# EAGLE design EFM32TG110_BreakoutBoard (EAGLE 6.2)
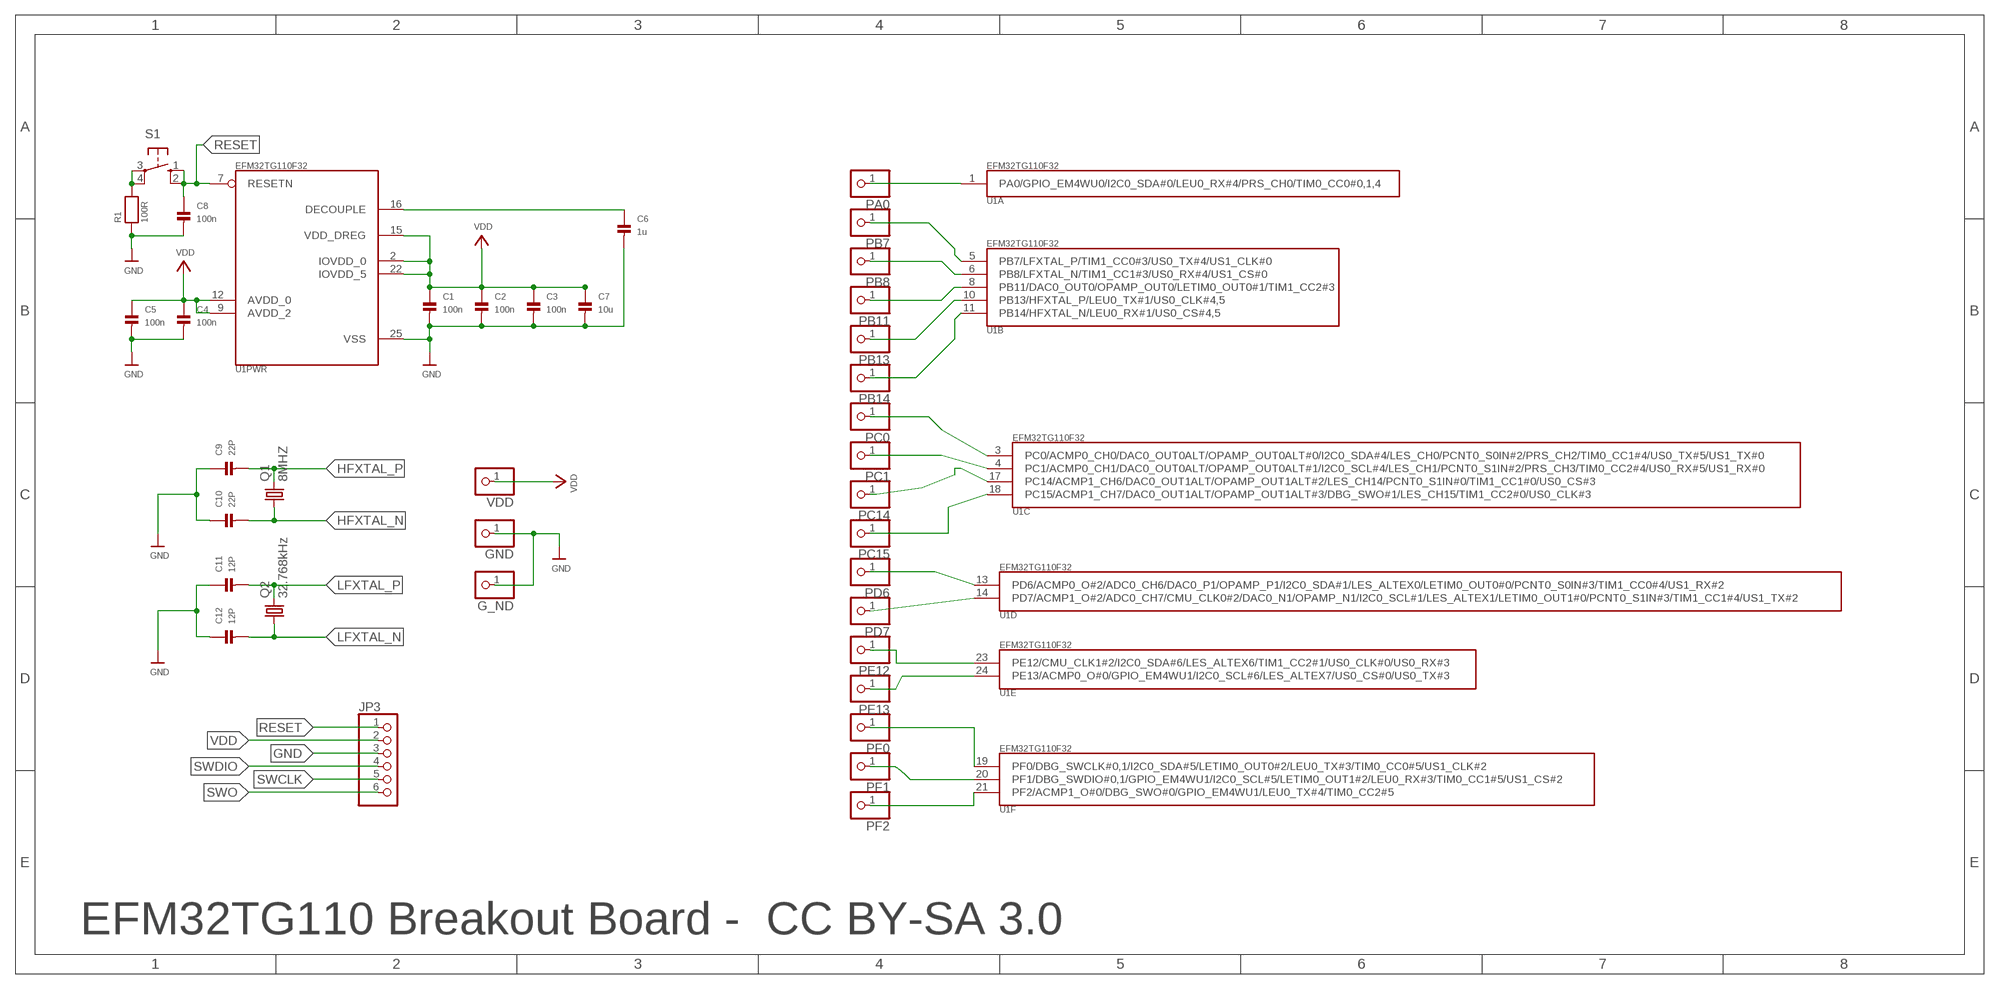
[diagram p0: schematic, sheet 1]

## Parts
C1  100n  CAP_CERAMIC0603  [0603]
C2  100n  CAP_CERAMIC0603  [0603]
C3  100n  CAP_CERAMIC0603  [0603]
C4  100n  CAP_CERAMIC0603  [0603]
C5  100n  CAP_CERAMIC0603  [0603]
C6  1u  CAP_CERAMIC0805  [0805]
C7  10u  CAP_CERAMIC0805  [0805]
C8  100n  CAP_CERAMIC0603  [0603]
C9  22P  CAP_CERAMIC0603  [0603]
C10  22P  CAP_CERAMIC0603  [0603]
C11  12P  CAP_CERAMIC0603  [0603]
C12  12P  CAP_CERAMIC0603  [0603]
G_ND  HEADER-1X1ROUND  [1X01_ROUND]
GND  HEADER-1X1ROUND  [1X01_ROUND]
JP3  HEADER-1X6  [1X06_OVAL]
PA0  HEADER-1X1ROUND  [1X01_ROUND]
PB7  HEADER-1X1ROUND  [1X01_ROUND]
PB8  HEADER-1X1ROUND  [1X01_ROUND]
PB11  HEADER-1X1ROUND  [1X01_ROUND]
PB13  HEADER-1X1ROUND  [1X01_ROUND]
PB14  HEADER-1X1ROUND  [1X01_ROUND]
PC0  HEADER-1X1ROUND  [1X01_ROUND]
PC1  HEADER-1X1ROUND  [1X01_ROUND]
PC14  HEADER-1X1ROUND  [1X01_ROUND]
PC15  HEADER-1X1ROUND  [1X01_ROUND]
PD6  HEADER-1X1ROUND  [1X01_ROUND]
PD7  HEADER-1X1ROUND  [1X01_ROUND]
PE12  HEADER-1X1ROUND  [1X01_ROUND]
PE13  HEADER-1X1ROUND  [1X01_ROUND]
PF0  HEADER-1X1ROUND  [1X01_ROUND]
PF1  HEADER-1X1ROUND  [1X01_ROUND]
PF2  HEADER-1X1ROUND  [1X01_ROUND]
Q1  8MHZ  CRYSTALHC49U70  [HC49U70]
Q2  32.768kHz  CRYSTALTC38H  [TC38H]
R1  100R  RESISTOR0603  [0603]
S1  10-XX  [B3F-10XX]
U1  EFM32TG110F32  [QFN24]
VDD  HEADER-1X1ROUND  [1X01_ROUND]

## Nets
GND [power]: C1.2 C2.2 C3.2 C4.2 C5.2 C6.2 C7.2 C8.2 C9.1 C10.1 C11.1 C12.1 G_ND.1 GND.1 JP3.3 R1.1 U1.25(PWR:VSS)
HFXTAL_N: C10.2 PB14.1 Q1.1 U1.11(B:PB14/HFXTAL_N/LEU0_RX#1/US0_CS#4,5)
HFXTAL_P: C9.2 PB13.1 Q1.2 U1.10(B:PB13/HFXTAL_P/LEU0_TX#1/US0_CLK#4,5)
LFXTAL_N: C12.2 PB8.1 Q2.1 U1.6(B:PB8/LFXTAL_N/TIM1_CC1#3/US0_RX#4/US1_CS#0)
LFXTAL_P: C11.2 PB7.1 Q2.2 U1.5(B:PB7/LFXTAL_P/TIM1_CC0#3/US0_TX#4/US1_CLK#0)
N$1: PA0.1 U1.1(A:PA0/GPIO_EM4WU0/I2C0_SDA#0/LEU0_RX#4/PRS_CH0/TIM0_CC0#0,1,4)
N$3: C6.1 U1.16(PWR:DECOUPLE)
N$5: PB11.1 U1.8(B:PB11/DAC0_OUT0/OPAMP_OUT0/LETIM0_OUT0#1/TIM1_CC2#3)
N$8: PC0.1 U1.3(C:PC0/ACMP0_CH0/DAC0_OUT0ALT/OPAMP_OUT0ALT#0/I2C0_SDA#4/LES_CH0/PCNT0_S0IN#2/PRS_CH2/TIM0_CC1#4/US0_TX#5/US1_TX#0)
N$9: PC1.1 U1.4(C:PC1/ACMP0_CH1/DAC0_OUT0ALT/OPAMP_OUT0ALT#1/I2C0_SCL#4/LES_CH1/PCNT0_S1IN#2/PRS_CH3/TIM0_CC2#4/US0_RX#5/US1_RX#0)
N$10: PC14.1 U1.17(C:PC14/ACMP1_CH6/DAC0_OUT1ALT/OPAMP_OUT1ALT#2/LES_CH14/PCNT0_S1IN#0/TIM1_CC1#0/US0_CS#3)
N$11: PC15.1 U1.18(C:PC15/ACMP1_CH7/DAC0_OUT1ALT/OPAMP_OUT1ALT#3/DBG_SWO#1/LES_CH15/TIM1_CC2#0/US0_CLK#3)
N$12: PD6.1 U1.13(D:PD6/ACMP0_O#2/ADC0_CH6/DAC0_P1/OPAMP_P1/I2C0_SDA#1/LES_ALTEX0/LETIM0_OUT0#0/PCNT0_S0IN#3/TIM1_CC0#4/US1_RX#2)
N$13: PD7.1 U1.14(D:PD7/ACMP1_O#2/ADC0_CH7/CMU_CLK0#2/DAC0_N1/OPAMP_N1/I2C0_SCL#1/LES_ALTEX1/LETIM0_OUT1#0/PCNT0_S1IN#3/TIM1_CC1#4/US1_TX#2)
N$14: PE12.1 U1.23(E:PE12/CMU_CLK1#2/I2C0_SDA#6/LES_ALTEX6/TIM1_CC2#1/US0_CLK#0/US0_RX#3)
N$15: PE13.1 U1.24(E:PE13/ACMP0_O#0/GPIO_EM4WU1/I2C0_SCL#6/LES_ALTEX7/US0_CS#0/US0_TX#3)
N$21: R1.2 S1.3(P) S1.4(P1)
RESET: C8.1 JP3.1 S1.1(S) S1.2(S1) U1.7(PWR:RESETN)
SWCLK: JP3.5 PF0.1 U1.19(F:PF0/DBG_SWCLK#0,1/I2C0_SDA#5/LETIM0_OUT0#2/LEU0_TX#3/TIM0_CC0#5/US1_CLK#2)
SWDIO: JP3.4 PF1.1 U1.20(F:PF1/DBG_SWDIO#0,1/GPIO_EM4WU1/I2C0_SCL#5/LETIM0_OUT1#2/LEU0_RX#3/TIM0_CC1#5/US1_CS#2)
SWO: JP3.6 PF2.1 U1.21(F:PF2/ACMP1_O#0/DBG_SWO#0/GPIO_EM4WU1/LEU0_TX#4/TIM0_CC2#5)
VDD [power]: C1.1 C2.1 C3.1 C4.1 C5.1 C7.1 JP3.2 U1.2(PWR:IOVDD_0) U1.9(PWR:AVDD_2) U1.12(PWR:AVDD_0) U1.15(PWR:VDD_DREG) U1.22(PWR:IOVDD_5) VDD.1

## Notes on the sheet
- EFM32TG110 Breakout Board -  CC BY-SA 3.0

## Library data of the parts
C1-C12 = myLibrary:CAP_CERAMIC: Ceramic Capacitors 0402 - 0402 Surface Mount Capacitors 16pF 50V 5% [Digikey: 445-4899-2-ND] 18pF 50V 5% [Digikey: 490-1281-2-ND] 22pF 50V 5% [Digikey: 490-1283-2-ND] 68pF 50V 5% [Digikey: 490-1289-2-ND] 0.1uF 10V 10% [Digikey: 490-1318-2-ND] 1.0uF 6.3V 10% [Digikey: 490-1320-2-ND] 0603 - 0603 Surface Mount Capacitors 16 pF 50V 5% [Digikey: 445-5051-2-ND] 22 pF 50V [Digikey: PCC220ACVTR-ND] 33 pF 50V 5% [Digikey: 490-1415-1-ND] 56pF 50V 5% [Digikey: 490-1421-1-ND] 220pF 50V 5% [Digikey: 445-1285-1-ND] 680 pF 50V 2200 pF 50V 5% C0G [Digikey: 445-1297-1-ND] 5600 pF 100V 5% X7R [Digikey: 478-3711-1-ND] 0.1 µF 25V 10% [Digikey: PCC2277TR-ND] 0.22 µF 16V 10% X7R [Digikey: 445-1318-1-ND] 1.0 µF 25V 10% [Digikey: 445-5146-2-ND] 0603 - RF Specific 3pF 250V +/-0.1pF RF [Digikey: 712-1347-1-ND] 18 pF 250V 5% [Digikey: 478-3505-1-ND or 712-1322-1-ND] 56 pF 250V 5% C0G RF [Digikey: 490-4867-1-ND] 68 pF 250V RF [Digikey: 490-4868-1-ND] 0805 - 0805 Surface Mount Capacitors 220 pF 250V 2% RF Ceramic Capacitor [Digikey: 712-1398-1-ND] 1000 pF 50V 2% NP0 Ceramic Capacitor [Digikey: 478-3760-1-ND] 0.1 µF 25V 10% Ceramic Capacitor [Digikey: PCC1828TR-ND] 1.0 µF 16V 10% Ceramic Capacitor[Digikey: 490-1691-2-ND] 10.0 µF 10V 10% Ceramic Capacitor[Digikey: 709-1228-1-ND] 10.0 uF 16V 10% Ceramic Capacitor [Digikey: 478-5165-2-ND] 47 uF 6.3V 20% Ceramic Capacitor [Digikey: 587-1779-1-ND or 399-5506-1-ND] 1206 - 1206 Surface Mount Capacitors 47uF 10V 20% Ceramic Capacitor [Digikey: 490-5528-1-ND or 399-5508-1-ND or 445-6010-1-ND]
G_ND GND PA0 PB7 PB8 PB11 PB13 PB14 PC0 PC1 PC14 PC15 PD6 PD7 PE12 PE13 PF0 PF1 PF2 VDD = myLibrary:HEADER-1X1: PIN HEADER
JP3 = myLibrary:HEADER-1X6: PIN HEADER
Q1 Q2 = crystal:CRYSTAL: CRYSTAL; OC_FARNELL: unknown; OC_NEWARK: unknown
R1 = myLibrary:RESISTOR: Resistors 0402 - 0402 Surface Mount Package 22 Ohm 1% 1/16W [Digikey: 311-22.0LRTR-ND] 33 Ohm 5% 1/16W 1.0K 5% 1/16W 1.5K 5% 1/16W 2.0K 1% 1/16W 10.0K 1% 1/16W [Digikey: 311-10.0KLRTR-ND] 10.0K 5% 1/16W [Digikey: RMCF0402JT10K0TR-ND] 12.1K 1% 1/16W [Digikey: 311-22.0LRTR-ND] 100.0K 5% 1/16W 0603 - 0603 Surface Mount Package 0 Ohm 1/10 Watt 1% Resistor 15 Ohm 1/10 Watt 1% Resistor 33 Ohm 1/10 Watt 1% Resistor 49.9 Ohm 1/10 Watt 1% Resistor 100 Ohm 1/10 Watt 1% Resistor 150 Ohm 1/10 Watt 1% Resistor 240 Ohm 1/10 Watt 1% Resistor 390 Ohm 1/10 Watt 1% Resistor 560 Ohm 1/10 Watt 1% Resistor 680 Ohm 1/10 Watt 1% Resistor 750 Ohm 1/10 Watt 1% Resistor 1.0K Ohm 1/10 Watt 1% Resistor 1.5K Ohm 1/10 Watt 1% Resistor 2.0K Ohm 1/10 Watt 1% Resistor 2.2K Ohm 1/10 Watt 1% Resistor 3.3K Ohm 1/10 Watt 1% Resistor 4.7K Ohm 1/10 Watt 1% Resistor 10.0K Ohm 1/10 Watt 1% Resistor 12.0K Ohm 1/10 Watt 1% Resistor 12.1K Ohm 1/10 Watt 1% Resistor 20.0K Ohm 1/10 Watt 1% Resistor 33.0K Ohm 1/10 Watt 1% Resistor 100.0K Ohm 1/10 Watt 1% Resistor 0805 - 0805 Surface Mount Package 0 Ohm 1/8 Watt 1% Resistor 33 Ohm 1/8 Watt 1% Resistor 100 Ohm 1/8 Watt 1% Resistor 150 Ohm 1/8 Watt 1% Resistor 200 Ohm 1/8 Watt 1% Resistor 240 Ohm 1/8 Watt 1% Resistor 330 Ohm 1/8 Watt 1% Resistor 390 Ohm 1/8 Watt 1% Resistor 470 Ohm 1/8 Watt 1% Resistor 1.0K Ohm 1/8 Watt 1% Resistor 1.5K Ohm 1/8 Watt 1% Resistor 2.0K Ohm 1/8 Watt 1% Resistor 4.7K Ohm 1/8 Watt 1% Resistor 5.1K Ohm 1/8 Watt 1% Resistor 5.6K Ohm 1/8 Watt 1% Resistor 10.0K Ohm 1/8 Watt 1% Resistor 22.0K Ohm 1/8 Watt 1% Resistor 33.0K Ohm 1/8 Watt 1% Resistor 100K Ohm 1/8 Watt 1% Resistor 1206 - 1206 Surface Mount Package 2012 - 2010 Surface Mount Package 0.11 Ohm 1/2 Watt 1% Resistor - Digikey: RHM.11UCT-ND
S1 = switch-omron:10-XX: OMRON SWITCH; MPN: B3F-1000; OC_FARNELL: 176432; OC_NEWARK: 36M3542
U1 = EnergyMicro:EFM32TG110F32: EFM32TG110F32 Tiny Microcontroller in 5mm x 5mm QFN24 package

## Net classes
0 default: width 0.254 mm, clearance 0.254 mm
1 power: width 0.406 mm, clearance 0.254 mm

## Board
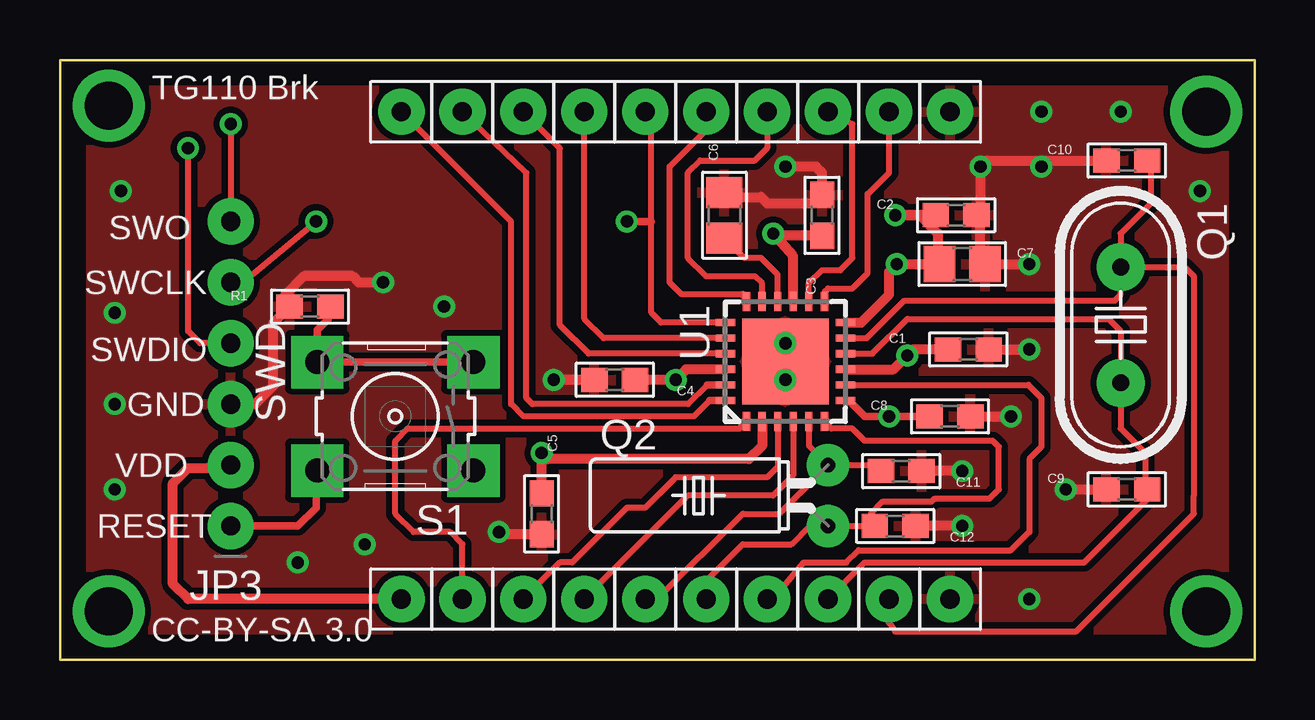
[diagram p1: board, top side]
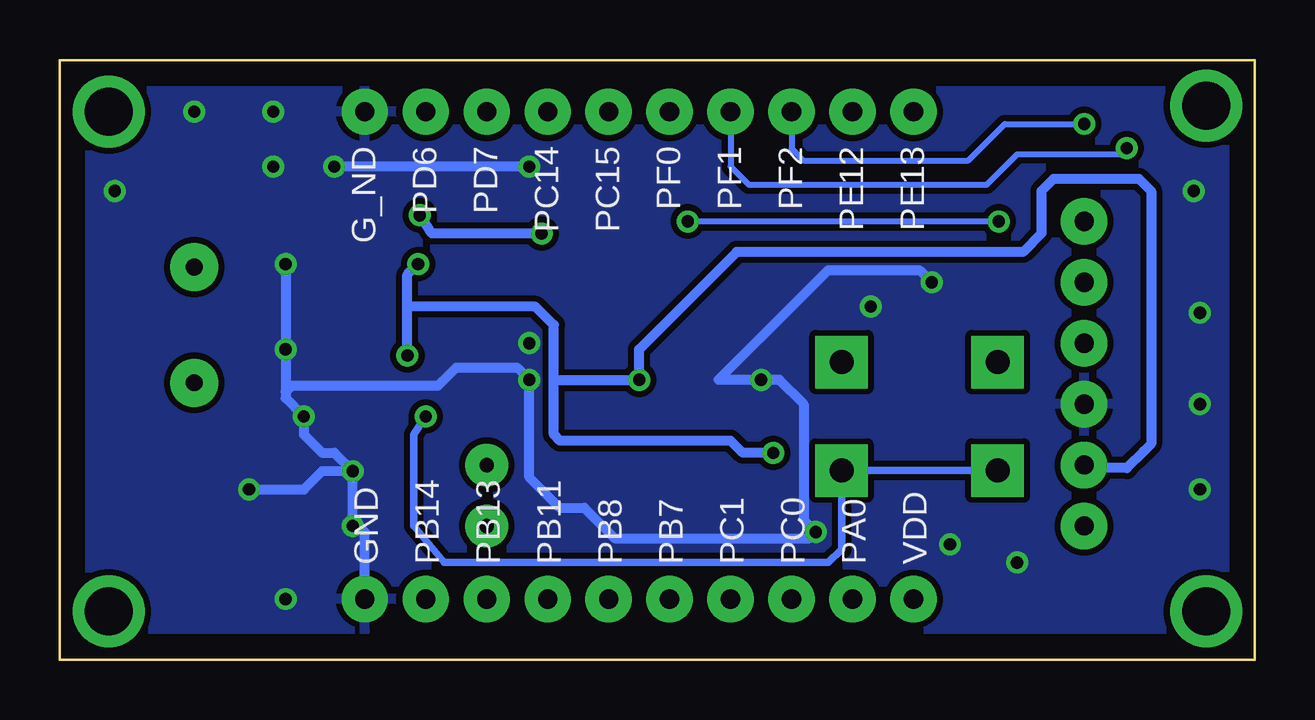
[diagram p2: board, bottom side, seen from below]

Size 49.78 x 25.02 mm. Coordinates in mm from the lower left corner, seen from the top.
Outline: 0,0 49.78,0 49.78,25.02 0,25.02 0,0
Copper layers (1*16): Top 0.035mm / dielectric 1.5mm / Bottom 0.035mm
Design rules: minimum track width 10mil, minimum drill 24mil, track to track 10mil, track to pad 10mil, pad to pad 10mil, via to via 10mil, smd to smd 0mil, copper to edge 40mil, drill to drill 8mil, minimum pad ring 10mil, minimum via ring 8mil, stop-mask expansion 4mil, vias tented up to drill 0mil, thermal gap 10mil

### Footprints (pad centres in the part's own frame; a part is rotated, then mirrored left to right if it is on the bottom)
0603 = smd 1.1 x 1: 1 -0.85,0; 2 0.85,0
0805 = smd 1.3 x 1.5: 1 -0.95,0; 2 0.95,0
1X01_ROUND = drill 0.8 pad 1.93: 1 0,0
1X06_OVAL = drill 0.8 pad 1.93: 1 -6.35,0; 2 -3.81,0; 3 -1.27,0; 4 1.27,0; 5 3.81,0; 6 6.35,0
HC49U70 = drill 0.7 pad 2: 1 -2.413,0; 2 2.413,0
TC38H = drill 0.6 pad 1.778: 1 -1.27,0; 2 1.27,0
B3F-10XX = drill 1 pad 2.184 square: 1 -3.251,2.261; 2 3.251,2.261; 3 -3.251,-2.261; 4 3.251,-2.261
QFN24 = smd 0.8 x 0.3: 1 -2.5,1.625; 2 -2.5,0.975; 3 -2.5,0.325; 4 -2.5,-0.325; 5 -2.5,-0.975; 6 -2.5,-1.625; 13 2.5,-1.625; 14 2.5,-0.975; 15 2.5,-0.325; 16 2.5,0.325; 17 2.5,0.975; 18 2.5,1.625 | smd 0.3 x 0.8: 7 -1.625,-2.5; 8 -0.975,-2.5; 9 -0.325,-2.5; 10 0.325,-2.5; 11 0.975,-2.5; 12 1.625,-2.5; 19 1.625,2.5; 20 0.975,2.5; 21 0.325,2.5; 22 -0.325,2.5; 23 -0.975,2.5; 24 -1.625,2.5 | smd 3.6 x 3.6: 25 0,0

### Placement (x,y rotation side)
C1  37.85,12.95 0 top
C2  37.34,18.54 0 top
C3  31.75,18.54 90 top
C4  23.11,11.68 180 top
C5  20.07,6.1 270 top
C6  27.69,18.54 90 top
C7  37.59,16.51 0 top
C8  37.08,10.16 0 top
C9  44.45,7.11 0 top
C10  44.45,20.83 0 top
C11  35.05,7.87 180 top
C12  34.8,5.59 180 top
G_ND  37.08,22.86 180 top
GND  37.08,2.54 0 top
JP3  7.11,11.94 90 top
PA0  16.76,2.54 0 top
PB7  24.38,2.54 0 top
PB8  26.92,2.54 0 top
PB11  29.46,2.54 0 top
PB13  32,2.54 0 top
PB14  34.54,2.54 0 top
PC0  19.3,2.54 0 top
PC1  21.84,2.54 0 top
PC14  29.46,22.86 180 top
PC15  26.92,22.86 180 top
PD6  34.54,22.86 180 top
PD7  32,22.86 180 top
PE12  16.76,22.86 180 top
PE13  14.22,22.86 180 top
PF0  24.38,22.86 180 top
PF1  21.84,22.86 180 top
PF2  19.3,22.86 180 top
Q1  44.2,13.97 270 top
Q2  32,6.86 90 top
R1  10.41,14.73 0 top
S1  13.97,10.16 180 top
U1  30.23,12.45 90 top
VDD  14.22,2.54 0 top

### Tracks (layer width: path | path; a pad name or v marks a point on that pad's centre or on a via)
GND  (via drill 0.51)
  Top 0.406: JP3.3 8.13,10.67 8.89,11.43 8.89,14.06 R1.1 9.4,14.9 9.4,15.24 10.16,16 12.19,16 12.45,15.75 v13.46,15.75 | C4.2 v20.57,11.68 | C6.2 27.69,19.3 29.21,19.3 29.46,19.05 31.41,19.05 C3.2 31.75,20.32 31.5,20.57 v30.23,20.57 | v38.35,20.57 38.35,20.32 | C10.1 38.61,20.83 v38.35,20.57 | v40.39,16.51 C7.2 38.35,16.7 38.35,18.38 C2.2 38.35,18.71 v38.35,20.57 | C1.2 v40.39,12.95 | v37.59,7.87 C11.1 | v37.59,5.59 C12.1 | C8.2 v39.62,10.16 | v30.23,13.21 v30.23,11.68 | v41.91,7.11 C9.1 | C5.2 18.38,5.25 v18.29,5.33
  Bottom 0.406: GND.1 37.08,5.33 v37.59,5.59 v37.59,7.87 | v41.91,7.11 39.62,7.11 38.86,7.87 v37.59,7.87 | v13.46,15.75 13.97,16.26 17.78,16.26 22.35,11.68 v20.57,11.68 19.81,11.68 18.8,10.67 18.8,5.84 v18.29,5.33 18.54,5.08 26.67,5.08 27.94,6.35 28.96,6.35 30.23,7.62 v30.23,11.68 30.73,12.19 33.27,12.19 34.04,11.43 40.13,11.43 40.39,11.18 | v30.23,20.57 v38.35,20.57 | v40.39,16.51 v40.39,12.95 40.39,11.18 | 40.39,11.18 40.39,10.92 v39.62,10.16 39.62,9.4 38.86,8.64 38.35,8.64 v37.59,7.87
  other vias: 40.89,22.86 16,14.73 2.29,7.11 2.29,14.48 12.7,4.83 44.2,22.86 40.39,2.54 47.5,19.56 40.89,20.57 9.91,4.06 2.29,10.67 2.54,19.56
  pour Top: -0.13,25.02 49.66,25.02 49.91,-0.13 0.13,0.13
  pour Bottom: -0.13,25.02 49.66,24.89 49.66,0 0.13,0.13
HFXTAL_N
  Top 0.254: U1.11 33.61,13.42 35.18,14.99 43.94,14.99 44.2,15.24 Q1.1 | 45.47,20.66 45.47,19.05 44.2,17.78 Q1.1 | Q1.1 46.86,16.38 47.24,16 47.24,6.86 47.24,6.1 42.34,1.19 34.8,1.19 34.54,1.55 PB14.1
  Top 0.305: 45.47,20.66 C10.2
HFXTAL_P
  Top 0.254: U1.10 33.85,12.77 35.31,14.22 43.69,14.22 44.2,13.72 Q1.2 44.2,9.65 45.21,8.64 45.21,7.2 C9.2 45.47,6.95 | PB13.1 33.53,4.06 42.67,4.06 45.47,6.86
  Top 0.305: 45.47,6.95 45.47,6.86
LFXTAL_N
  Top 0.254: C12.2 Q2.1 31.24,5.59 30.48,4.83 28.45,4.83 26.92,3.3 PB8.1 | 33.78,5.75 33.78,6.1 34.29,6.6 36.32,6.6 36.45,6.73 38.73,6.73 39.12,7.11 39.12,8.89 38.86,9.14 33.53,9.14 33.02,9.65 32.15,9.65 U1.6
  Top 0.305: 33.78,5.75 C12.2
LFXTAL_P
  Top 0.254: Q2.2 33.95,8.13 | 24.89,2.54 28.45,6.1 29.97,6.1 Q2.2 | U1.5 31.2,8.93 Q2.2
  Top 0.305: 33.95,8.13 C11.2 | PB7.1 24.89,2.54
N$1
  Top 0.254: PA0.1 16.76,4.83 16.26,5.33 14.73,5.33 13.97,6.1 13.97,9.14 14.48,9.65 28.31,9.65 U1.1
  Top 0.305: U1.1 28.6,9.8
N$2  (via drill 2)
  other vias: 47.75,22.86
N$3
  Top 0.254: U1.16 29.9,16.07 29.21,16.76 28.51,16.76 C6.1
N$4  (via drill 2)
  other vias: 2.03,23.11
N$5
  Top 0.254: PB11.1 29.72,2.54 30.99,4.06 32.77,4.06 33.27,4.57 39.62,4.57 40.39,5.33 40.39,8.38 40.89,8.89 40.89,10.92 40.34,11.47 U1.8
N$6  (via drill 2)
  other vias: 2.03,2.03
N$7  (via drill 2)
  other vias: 47.75,2.03
N$8
  Top 0.254: U1.3 29.9,8.06 29.46,7.62 25.65,7.62 24.38,6.35 23.62,6.35 21.34,4.06 20.83,4.06 PC0.1
N$9
  Top 0.254: U1.4 30.55,7.69 29.72,6.86 26.16,6.86 PC1.1
N$10
  Top 0.254: 29.21,14.99 U1.17 29.25,15.71 28.96,16 26.92,16 26.16,16.76 26.16,20.32 26.67,20.83 28.96,20.83 29.46,21.34 PC14.1
N$11
  Top 0.254: U1.18 28.6,15.09 | 28.45,15.24 25.91,15.24 25.4,15.75 25.4,20.57 26.92,22.1 PC15.1
  Top 0.305: 28.6,15.09 28.45,15.24
N$12
  Top 0.254: PD6.1 34.54,20.32 33.66,19.43 33.66,16.13 33.02,15.49 32,15.49 31.85,15.34 U1.13
N$13
  Top 0.254: U1.14 31.2,15.71 31.75,16.26 32.51,16.26 33.02,16.76 33.02,22.35 PD7.1
N$14
  Top 0.254: 26.97,11.47 26.16,10.67 19.69,10.67 19.43,10.92 19.43,20.32 PE12.1
  Top 0.305: U1.23 26.97,11.47
N$15
  Top 0.254: 27.08,10.82 26.42,10.16 19.3,10.16 18.8,10.67 18.8,18.29 PE13.1
  Top 0.305: U1.24 27.08,10.82
N$21
  Top 0.305: S1.3 S1.4 10.72,13.77 11.18,14.22 11.18,14.64
  Top 0.406: 11.18,14.64 R1.2
RESET  (via drill 0.51)
  Top 0.254: 10.67,7.85 S1.2
  Top 0.305: U1.7 32.87,10.82 33.53,10.16 v34.54,10.16 C8.1 | JP3.1 9.91,5.59 10.67,6.35 10.67,7.85
  Bottom 0.305: v34.54,10.16 35.05,9.4 35.05,5.59 33.78,4.06 17.78,4.06 17.22,4.62 S1.1 S1.2
SWCLK  (via drill 0.51)
  Top 0.254: U1.19 25.05,14.07 24.64,14.48 24.64,18.29 24.64,22.61 PF0.1 | JP3.5 7.62,15.75 v10.67,18.29
  Top 0.305: v23.62,18.29 24.64,18.29
  Bottom 0.254: v10.67,18.29 v23.62,18.29
SWDIO  (via drill 0.51)
  Top 0.254: U1.20 22.65,13.42 21.84,14.22 PF1.1 | JP3.4 5.84,13.21 5.33,13.72 v5.33,21.34
  Bottom 0.254: PF1.1 21.84,20.57 21.08,19.81 11.18,19.81 9.91,21.08 5.59,21.08 v5.33,21.34
SWO  (via drill 0.51)
  Top 0.254: U1.21 22.03,12.77 20.83,13.97 20.83,21.34 PF2.1 | v7.11,22.35 JP3.6
  Bottom 0.254: PF2.1 19.3,21.34 18.8,20.83 11.94,20.83 10.41,22.35 v7.11,22.35
VDD  (via drill 0.51)
  Top 0.406: U1.15 30.55,16.84 v29.72,17.78 29.81,17.69 C3.1 | C4.1 v25.65,11.68 26.09,12.12 U1.22 | U1.2 29.25,8.93 28.7,8.38 20.32,8.38 v20.07,8.64 C5.1 | C2.1 v34.8,18.54 35.81,18.54 36.58,17.78 36.58,16.58 C7.1 v34.86,16.51 34.54,16.19 34.54,15.24 33.38,14.07 U1.12 | C1.1 35.56,12.95 v35.31,12.7 34.73,12.12 U1.9 | VDD.1 5.33,2.54 4.7,3.18 4.7,7.37 5.33,8 6.99,8 JP3.2
  Bottom 0.406: 29.21,11.68 v25.65,11.68 25.65,12.95 21.59,17.02 9.65,17.02 8.89,17.78 8.89,19.56 8.38,20.07 4.83,20.07 4.32,19.56 4.32,9.02 4.63,8.7 5.33,8 6.99,8 JP3.2 | v29.72,17.78 34.29,17.78 v34.8,18.54 | v20.07,8.64 21.34,8.64 21.84,9.14 28.96,9.14 29.21,9.4 29.21,11.68 | v35.31,12.7 35.31,14.73 | 35.31,14.73 29.97,14.73 29.21,13.97 29.21,11.68 | 35.31,14.73 35.31,16.07 v34.86,16.51

### Text on the board
tNames: TG110 Brk | SWO | SWCLK | SWDIO | GND | SWD | VDD | RESET | CC-BY-SA 3.0